# EAGLE design generator_DBD (EAGLE 7.2.0)
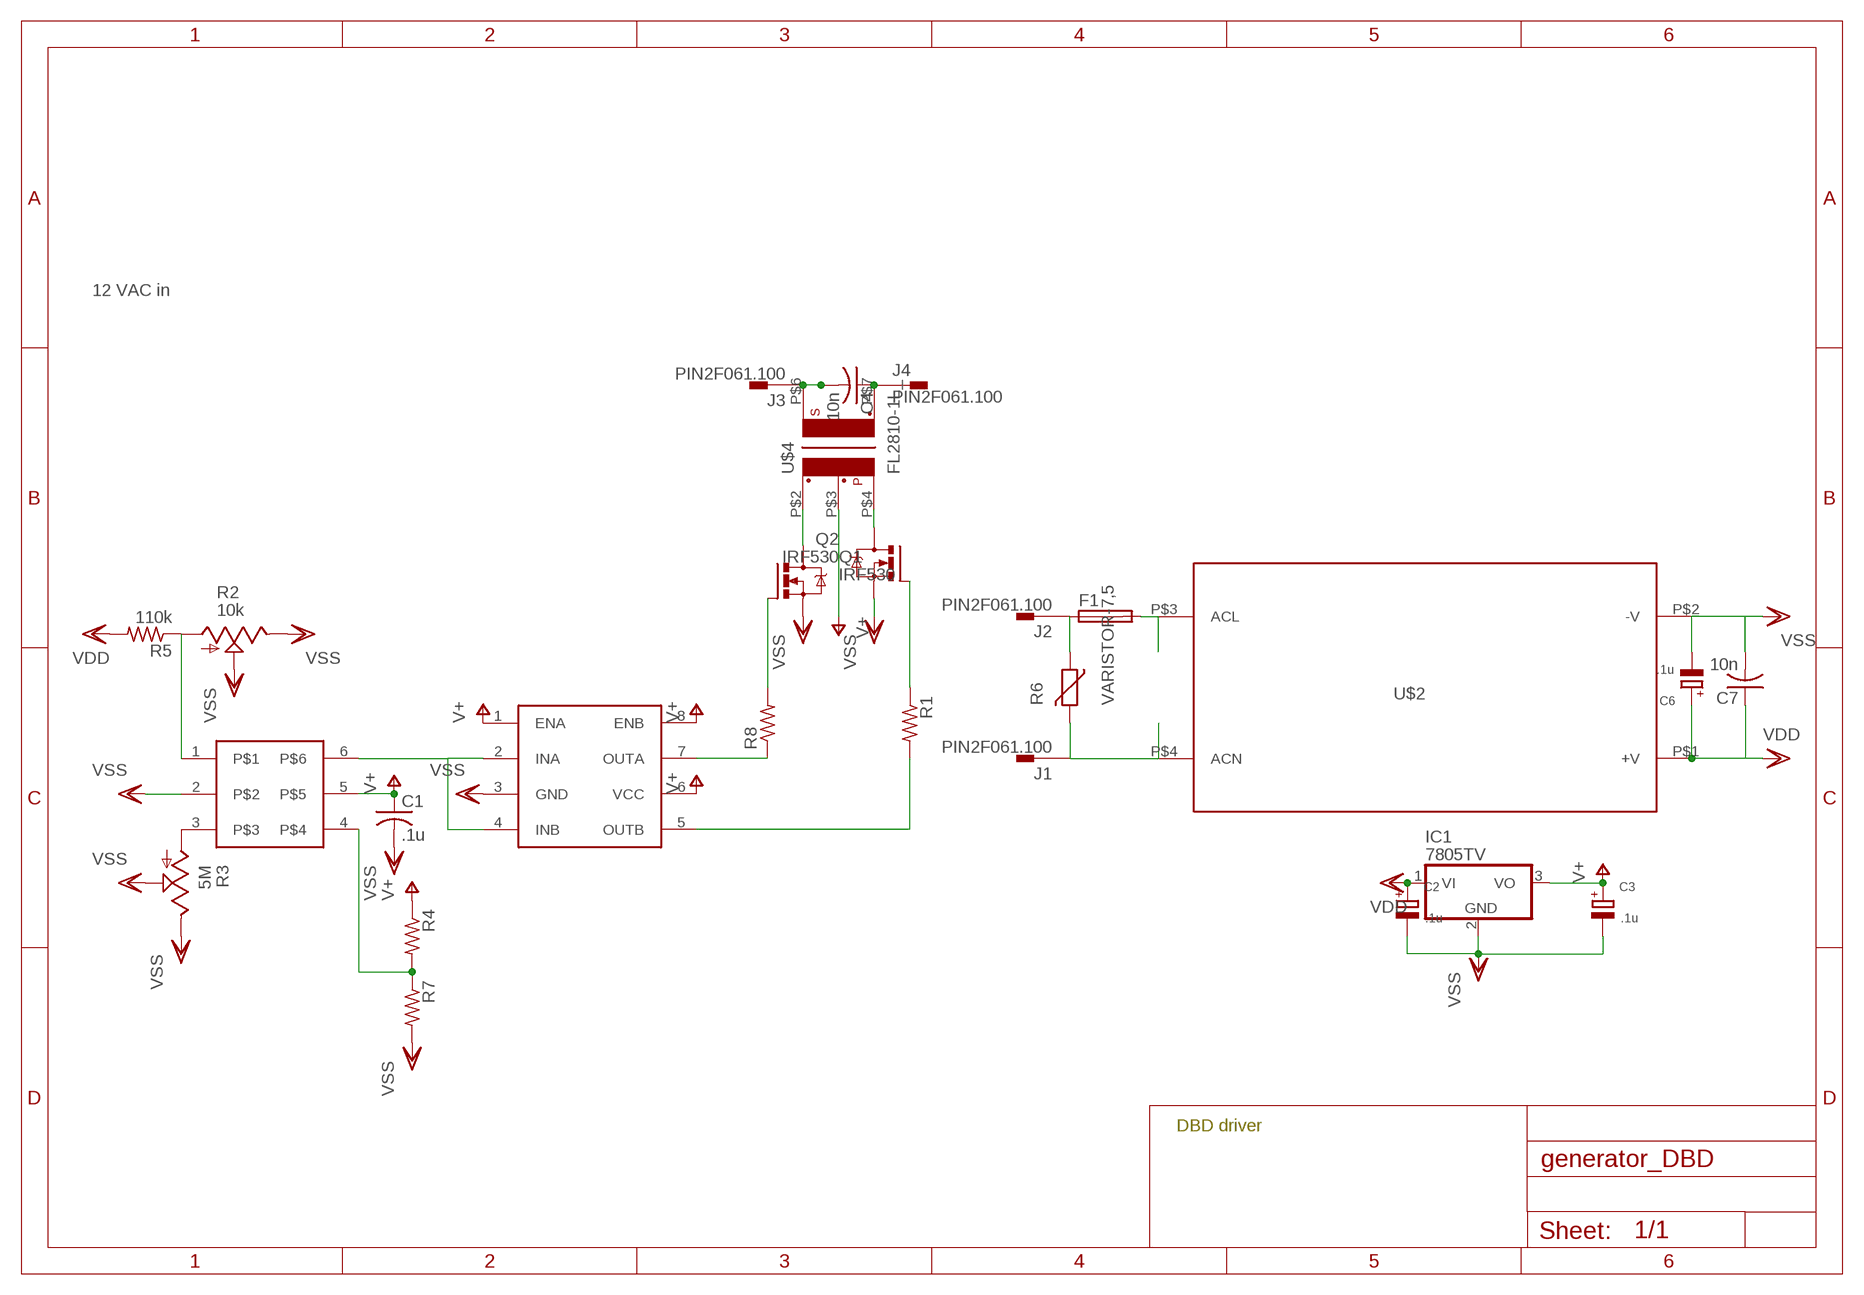
[diagram p0: schematic, sheet 1]

## Parts
C1  .1u  C-US075-042X103  [C075-042X103]
C2  .1u  CPOL-EUE5-8.5  [E5-8,5]
C3  .1u  CPOL-EUE5-8.5  [E5-8,5]
C4  10n  C-US075-042X103  [C075-042X103]
C6  .1u  CPOL-EUE5-8.5  [E5-8,5]
C7  10n  C-US075-042X103  [C075-042X103]
F1  SH25  [SH25]
IC1  7805TV  [TO220V]
J1  PIN2F061.100  [F061.100]
J2  PIN2F061.100  [F061.100]
J3  PIN2F061.100  [F061.100]
J4  PIN2F061.100  [F061.100]
Q1  IRF530  [TO220BV]
Q2  IRF530  [TO220BV]
R1  R-US_0207/10  [0207/10]
R2  10k  TRIM_US-PT-SPIN  [PT-SPIN-2]
R3  5M  TRIM_US-PTSPIN  [PT-SPIN-2]
R4  R-US_0207/10  [0207/10]
R5  110k  R-US_0207/10  [0207/10]
R6  VARISTOR-7,5  [R-7,5]
R7  R-US_0207/10  [0207/10]
R8  R-US_0207/15  [0207/15]
U$1  UCC27425  [DIL08]
U$2  IRM-60-12  [IRM-60-12]
U$3  LTC6992SMD  [SOT23-6]
U$4  FL2810-1L_  [4]

## Nets
N$1: Q2.G R1.1
N$2: R3.A U$3.3
N$3: R2.A R5.1 U$3.1
N$4: F1.1 J2.A1 J2.A2 R6.1
N$5: U$1.2(INA) U$1.4(INB) U$3.6
N$6: J1.A1 J1.A2 R6.2 U$2.P$4(ACN)
N$7: R1.2 U$1.5(OUTB)
N$8: F1.2 U$2.P$3(ACL)
N$9: R4.2 R7.1 U$3.4
N$11: R8.1 U$1.7(OUTA)
N$13: Q1.G R8.2
N$14: Q1.D U$4.P$2
N$15: Q2.D U$4.P$4
N$16: C4.2 J3.A1 J3.A2 U$4.P$6
N$17: C4.1 J4.A1 J4.A2 U$4.P$7
V+: C1.1 C3.+ IC1.3(VO) R4.1 U$1.1(ENA) U$1.6(VCC) U$1.8(ENB) U$3.5 U$4.P$3
VDD: C2.+ C6.+ C7.1 IC1.1(VI) R5.2 U$2.P$1(+V)
VSS: C1.2 C2.- C3.- C6.- C7.2 IC1.2(GND) Q1.S Q2.S R2.E R2.S R3.E R3.S R7.2 U$1.3(GND) U$2.P$2(-V) U$3.2

## Notes on the sheet
- 12 VAC in
- DBD driver

## Library data of the parts
C1 C4 C7 = rcl:C-US: CAPACITOR, American symbol
C2 C3 C6 = rcl:CPOL-EU: POLARIZED CAPACITOR, European symbol
F1 = fuse:SH25: FUSE HOLDER grid 25 mm, OGN0031 8211, Schurter (Buerklin); MF: SCHURTER; MPN: 0031.8211; OC_FARNELL: 1162741; OC_NEWARK: 96B9380
IC1 = linear:78*: Positive VOLTAGE REGULATOR Source: http://cache.national.com/ds/LM/LM78L05.pdf http://www.fairchildsemi.com/ds/LM/LM7805.pdf
J1-J4 = con-faston:PIN2: Flachstecker Typ Tyco/Electronics/AMP TAB, FASTON Printed Circuit Board Tabs Source: http://www.buerklin.com, http://catalog.tycoelectronics.com; OC_FARNELL: unknown; OC_NEWARK: unknown
Q1 Q2 = transistor-power:IRF530: HEXFET Power MOSFET
R1 R4 R5 R7 R8 = resistor:R-US_: RESISTOR, American symbol
R2 R3 = pot:TRIM_US-: POTENTIOMETER
R6 = varistor:VARISTOR: VARISTOR
U$1 = texas:UCC27425
U$2 = meanwell:IRM-60-12
U$3 = linear-technology:LTC6992
U$4 = trafo:FL2810-1L_

## Board
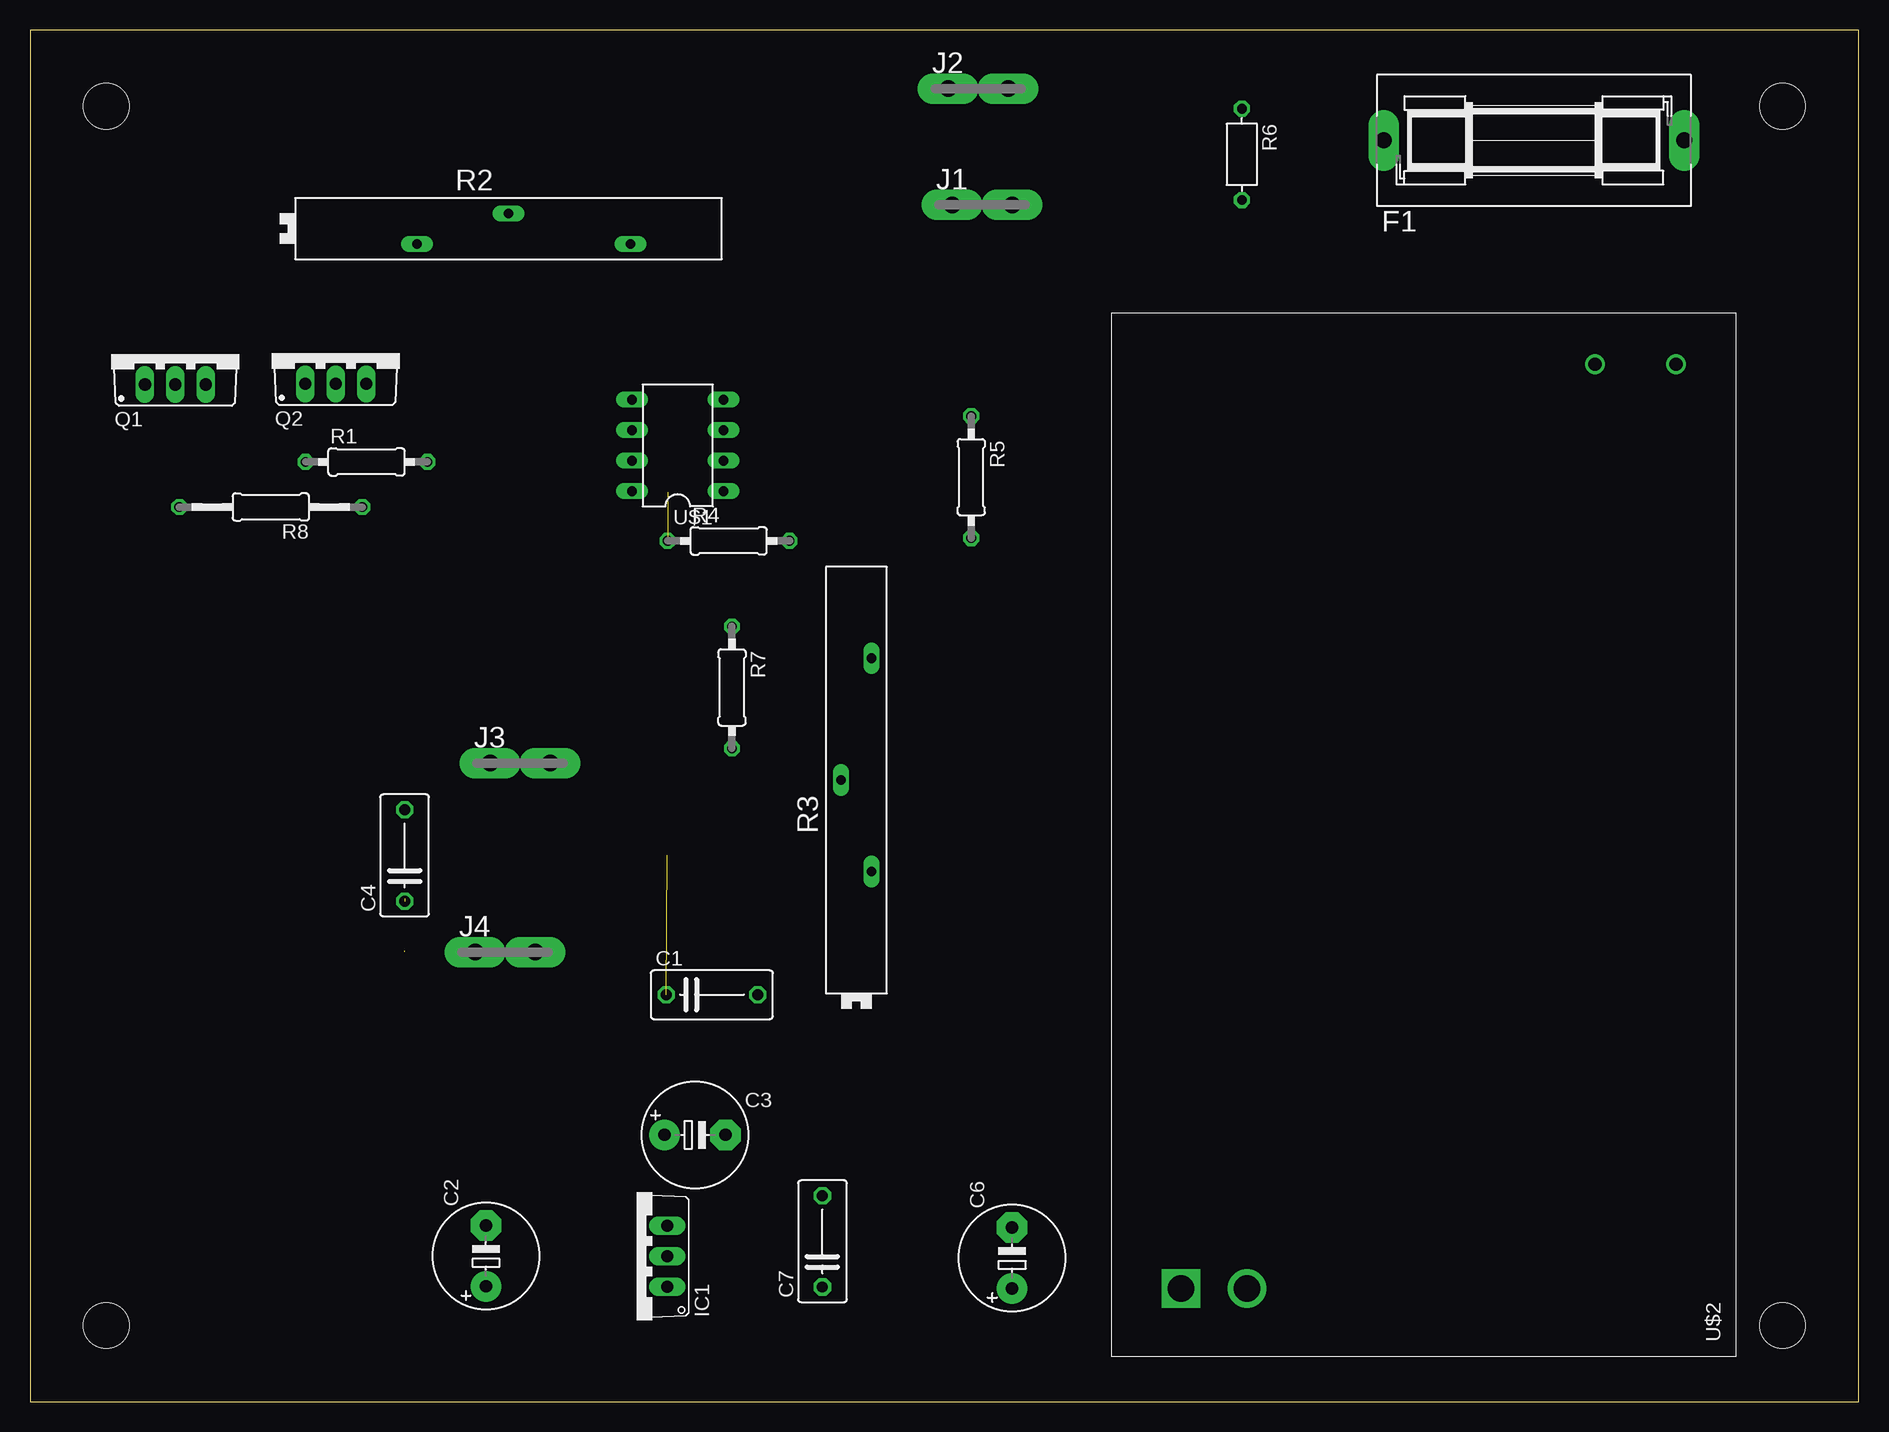
[diagram p1: board, top side]
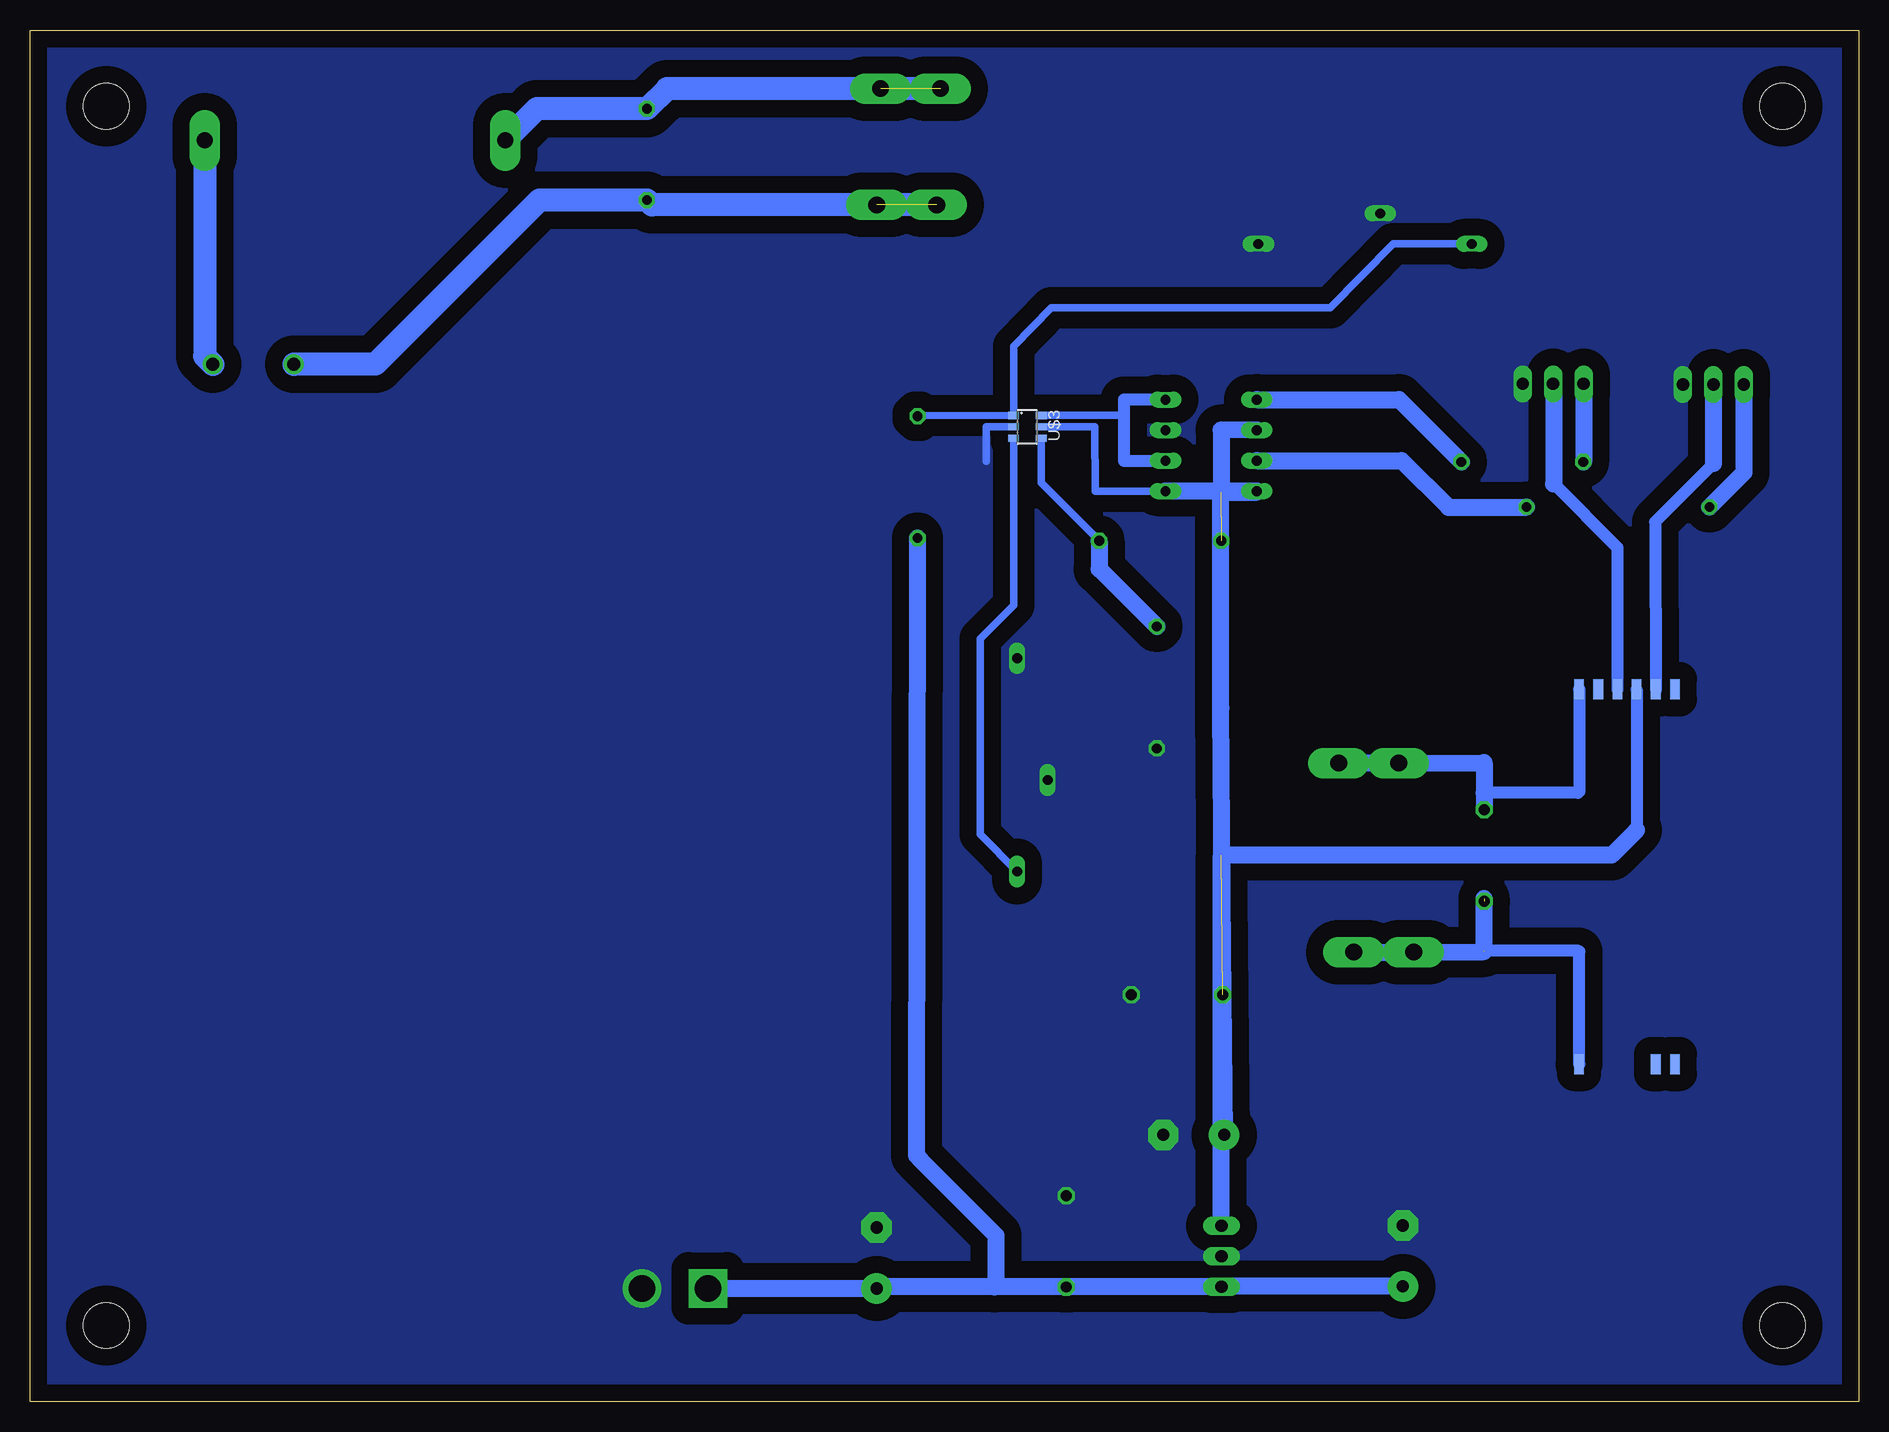
[diagram p2: board, bottom side, seen from below]

Size 152.4 x 114.3 mm. Coordinates in mm from the lower left corner, seen from the top.
Outline: 0,0 152.4,0 152.4,114.3 0,114.3 0,0
Copper layers (1*16): Top 0.035mm / dielectric 1.5mm / Bottom 0.035mm
Design rules "default *": minimum track width 10mil, minimum drill 24mil, track to track 8mil, track to pad 8mil, pad to pad 8mil, via to via 8mil, smd to smd 8mil, copper to edge 5mil, drill to drill 8mil, minimum pad ring 10mil, minimum via ring 8mil, stop-mask expansion 4mil, vias tented up to drill 0mil, thermal gap 10mil
Holes 3.8 mm at 6.35,6.35 146.05,107.95 146.05,6.35 6.35,107.95

### Footprints (pad centres in the part's own frame; a part is rotated, then mirrored left to right if it is on the bottom)
C075-042X103 = drill 0.914 octagon: 1 -3.81,0; 2 3.81,0
E5-8,5 = drill 1.016 pad 2.54: + -2.54,0 | drill 1.016 pad 2.54 octagon: - 2.54,0
SH25 = drill 1.321 pad 2.54 long: 1 -12.522,0; 2 12.522,0
TO220V = drill 1.016 long: 1 -2.54,-2.54; 2 0,-2.54; 3 2.54,-2.54
F061.100 = drill 1.4 pad 2.54 long: A1 -2.5,0; A2 2.5,0
TO220BV = drill 1.016 long: D 0,-2.54; G -2.54,-2.54; S 2.54,-2.54
0207/10 = drill 0.813 octagon: 1 -5.08,0; 2 5.08,0
PT-SPIN-2 = drill 0.813 long: A -6.35,-1.27; E 11.43,-1.27; S 1.27,1.27
R-7,5 = drill 0.813 octagon: 1 -3.81,0; 2 3.81,0
0207/15 = drill 0.813 octagon: 1 -7.62,0; 2 7.62,0
DIL08 = drill 0.813 long: 1 -3.81,-3.81; 2 -1.27,-3.81; 3 1.27,-3.81; 4 3.81,-3.81; 5 3.81,3.81; 6 1.27,3.81; 7 -1.27,3.81; 8 -3.81,3.81
IRM-60-12 = drill 2.2 square: P$1 5.7,46.25 | drill 2.2: P$2 5.7,40.75 | drill 1.1: P$3 82.7,5; P$4 82.7,11.75
SOT23-6 = smd 0.6 x 0.9: 1 -0.95,-1.15; 2 0,-1.15; 3 0.95,-1.15; 4 0.95,1.15; 5 0,1.15; 6 -0.95,1.15
4 = smd 1.676 x 0.813: P$1 31.242,0; P$2 31.242,1.6; P$3 31.242,3.2; P$4 31.242,4.801; P$5 31.242,6.401; P$6 31.242,8.001; P$7 0,8.001; P$8 0,1.6; P$9 0,0

### Placement (x,y rotation side)
C1  56.82,33.91 0 top
C2  38,12.14 90 top
C3  55.42,22.23 0 top
C4  31.22,45.52 90 top
C6  81.84,11.96 90 top
C7  66.04,13.36 90 top
F1  125.32,105.11 0 top
IC1  50.57,12.12 90 top
J1  79.35,99.72 0 top
J2  79.02,109.42 0 top
J3  40.84,53.21 0 top
J4  39.6,37.47 0 top
Q1  12.12,87.3 0 top
Q2  25.48,87.35 0 top
R1  28.04,78.31 0 top
R2  38.61,97.74 0 top
R3  68.86,50.52 90 top
R4  58.22,71.73 0 top
R5  78.44,77.04 270 top
R6  100.99,103.94 270 top
R7  58.5,59.51 270 top
R8  20.07,74.55 180 top
U$1  53.98,79.68 90 top
U$2  142.16,3.73 90 top
U$3  69.29,81.23 270 bottom
U$4  15.32,28.12 90 bottom

### Tracks (layer width: path | path; a pad name or v marks a point on that pad's centre or on a via)
N$1
  Bottom 1.422: Q2.G 22.94,78.33 R1.1
N$2
  Bottom 0.61: U$3.3 70.44,66.36 73.23,63.58 73.23,47.27 R3.A
N$3
  Bottom 0.61: R5.1 78.46,82.15 U$3.1 70.44,87.96 67.29,91.16 44.04,91.16 38.81,96.47 R2.A
N$4  (1 unrouted)
  Bottom 1.93: J2.A1 99.31,109.42 R6.1 110.16,107.75 F1.1
N$5
  Bottom 0.61: U$3.6 61.24,82.18
  Bottom 1.016: U$1.4 61.24,83.49 61.24,82.18 61.24,78.38 57.78,78.38 U$1.2
N$6  (1 unrouted)
  Bottom 1.93: J1.A1 100.58,99.72 R6.2 109.96,100.13 123.62,86.46 130.39,86.46 U$2.P$4
N$7
  Bottom 1.422: U$1.5 38.3,83.49 R1.2
N$8
  Bottom 1.93: F1.2 137.85,87.12 U$2.P$3
N$9
  Bottom 0.61: U$3.4 68.14,76.57 R4.2
  Bottom 1.422: R4.2 63.3,69.39 R7.1
N$11
  Bottom 1.422: U$1.7 38.1,78.41 34.19,74.52 27.94,74.52 R8.1
N$13
  Bottom 1.422: Q1.G 9.58,77.42 R8.2
N$14
  Bottom 1.016: 12.12,78.16 16.97,73.3 16.94,72.9 U$4.P$2
  Bottom 1.422: Q1.D 12.12,78.16
N$15
  Bottom 1.016: 25.43,76.48 20.12,71.17 U$4.P$4
  Bottom 1.422: Q2.D 25.43,84.76 25.43,76.48
N$16
  Bottom 1.016: 31.22,51.46 31.22,50.72 23.39,50.72 23.29,50.83 23.29,59.33 U$4.P$6
  Bottom 1.422: J3.A2 J3.A1 31.22,53.25 31.22,50.72 C4.2
N$17  (2 unrouted)
  Bottom 1.016: 32.23,37.57 31.22,37.57 23.34,37.57 23.29,37.52 23.29,28.14 U$4.P$7
  Bottom 1.422: 31.22,37.57 31.22,41.91 | J4.A2 J4.A1 37.07,37.44 31.24,37.49
V+  (2 unrouted)
  Bottom 0.61: U$1.1 63.63,75.87 63.65,81.23 U$3.5
  Bottom 1.016: U$4.P$3 18.52,47.62
  Bottom 1.422: IC1.3 53.11,45.54 | 53.11,45.54 C3.+ 53.16,57.81 53.16,75.79 | 18.52,47.62 20.6,45.54 53.11,45.54 | U$1.6 53.14,80.97 53.14,75.82 53.16,75.79 | 53.16,75.79 50.16,75.79 U$1.8 U$1.1
VDD
  Bottom 1.422: R5.2 78.51,20.5 78.18,20.12 71.91,13.84 71.91,9.65 72.01,9.55 | U$2.P$1 82.42,9.43 | 82.42,9.43 81.85,9.43 C6.+ | C2.+ 53.09,9.6 IC1.1 66.02,9.58 C7.1 72.01,9.55 | 72.01,9.55 82.31,9.55 82.42,9.43
VSS
  Bottom 0.61: U$3.2 72.69,81.23 72.69,78.36
  pour Bottom (isolate 1.422, no thermals): 152.48,114.2 152.48,0 -0.2,0 -0.18,114.38